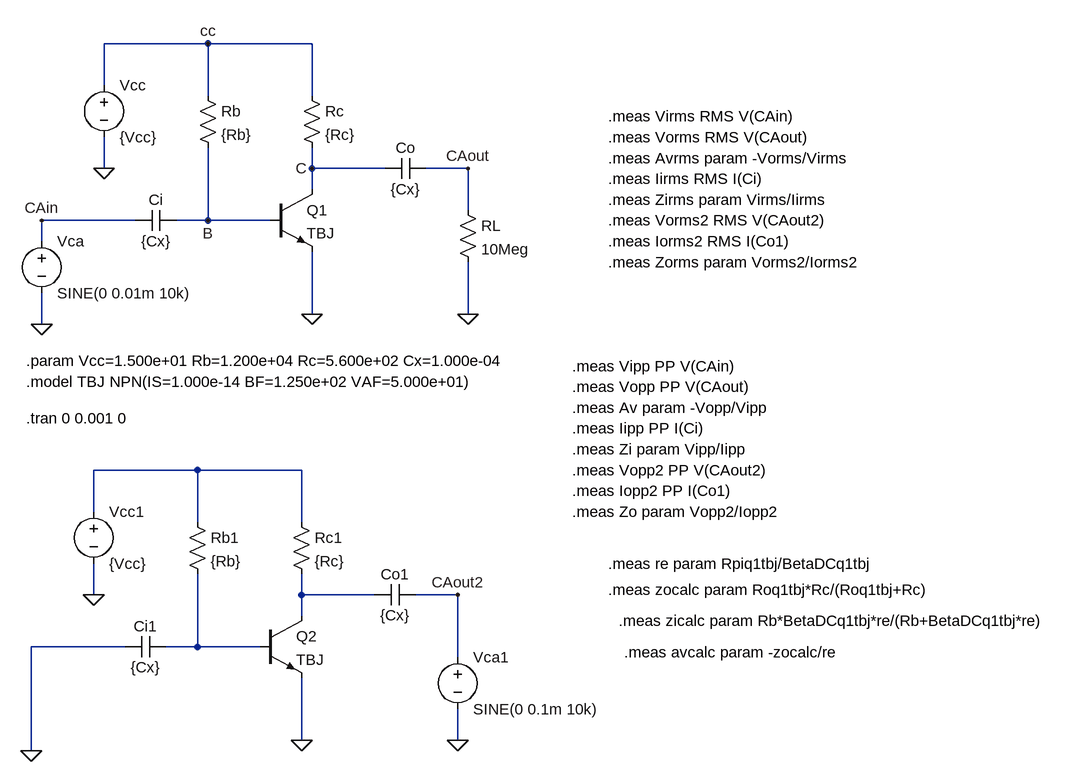
[diagram p0: schematic TBJ01CA.asc]
TBJ01CA.asc, the LTspice schematic file:
Version 4
SHEET 1 1656 1092
WIRE 128 -16 -32 -16
WIRE 288 -16 128 -16
WIRE -32 48 -32 -16
WIRE 128 64 128 -16
WIRE 288 64 288 -16
WIRE -32 176 -32 128
WIRE 288 176 288 144
WIRE 400 176 288 176
WIRE 528 176 464 176
WIRE 288 208 288 176
WIRE 528 240 528 176
WIRE 16 256 -128 256
WIRE 128 256 128 144
WIRE 128 256 80 256
WIRE 224 256 128 256
WIRE -128 288 -128 256
WIRE 288 400 288 304
WIRE 528 400 528 320
WIRE -128 416 -128 368
WIRE 112 640 -48 640
WIRE 272 640 112 640
WIRE -48 704 -48 640
WIRE 112 720 112 640
WIRE 272 720 272 640
WIRE -48 832 -48 784
WIRE 272 832 272 800
WIRE 384 832 272 832
WIRE 512 832 448 832
WIRE 272 864 272 832
WIRE 0 912 -144 912
WIRE 112 912 112 800
WIRE 112 912 64 912
WIRE 208 912 112 912
WIRE 512 928 512 832
WIRE 272 1056 272 960
WIRE 512 1056 512 1008
WIRE -144 1072 -144 912
FLAG -32 176 0
FLAG 288 400 0
FLAG -128 416 0
FLAG 128 -16 cc
FLAG -128 256 CAin
FLAG 528 400 0
FLAG 528 176 CAout
FLAG 128 256 B
FLAG 288 176 C
FLAG -48 832 0
FLAG 272 1056 0
FLAG -144 1072 0
FLAG 512 1056 0
FLAG 512 832 CAout2
SYMBOL res 112 48 R0
SYMATTR InstName Rb
SYMATTR Value {Rb}
SYMBOL res 272 48 R0
SYMATTR InstName Rc
SYMATTR Value {Rc}
SYMBOL voltage -32 32 R0
WINDOW 123 0 0 Left 0
WINDOW 39 0 0 Left 0
SYMATTR InstName Vcc
SYMATTR Value {Vcc}
SYMBOL npn 224 208 R0
SYMATTR InstName Q1
SYMATTR Value TBJ
SYMBOL cap 80 240 R90
WINDOW 0 0 32 VBottom 2
WINDOW 3 32 32 VTop 2
SYMATTR InstName Ci
SYMATTR Value {Cx}
SYMBOL cap 464 160 R90
WINDOW 0 0 32 VBottom 2
WINDOW 3 32 32 VTop 2
SYMATTR InstName Co
SYMATTR Value {Cx}
SYMBOL voltage -128 272 R0
WINDOW 123 0 0 Left 0
WINDOW 39 0 0 Left 0
SYMATTR InstName Vca
SYMATTR Value SINE(0 0.01m 10k)
SYMBOL res 512 224 R0
SYMATTR InstName RL
SYMATTR Value 10Meg
SYMBOL res 96 704 R0
SYMATTR InstName Rb1
SYMATTR Value {Rb}
SYMBOL res 256 704 R0
SYMATTR InstName Rc1
SYMATTR Value {Rc}
SYMBOL voltage -48 688 R0
WINDOW 123 0 0 Left 0
WINDOW 39 0 0 Left 0
SYMATTR InstName Vcc1
SYMATTR Value {Vcc}
SYMBOL npn 208 864 R0
SYMATTR InstName Q2
SYMATTR Value TBJ
SYMBOL cap 64 896 R90
WINDOW 0 0 32 VBottom 2
WINDOW 3 32 32 VTop 2
SYMATTR InstName Ci1
SYMATTR Value {Cx}
SYMBOL cap 448 816 R90
WINDOW 0 0 32 VBottom 2
WINDOW 3 32 32 VTop 2
SYMATTR InstName Co1
SYMATTR Value {Cx}
SYMBOL voltage 512 912 R0
WINDOW 123 0 0 Left 0
WINDOW 39 0 0 Left 0
SYMATTR InstName Vca1
SYMATTR Value SINE(0 0.1m 10k)
TEXT -152 560 Left 2 !.tran 0 0.001 0
TEXT -152 472 Left 2 !.param Vcc=1.500e+01 Rb=1.200e+04 Rc=5.600e+02 Cx=1.000e-04
TEXT -152 504 Left 2 !.model TBJ NPN(IS=1.000e-14 BF=1.250e+02 VAF=5.000e+01)
TEXT 688 480 Left 2 !.meas Vipp PP V(CAin)
TEXT 688 576 Left 2 !.meas Iipp PP I(Ci)
TEXT 688 608 Left 2 !.meas Zi param Vipp/Iipp
TEXT 688 512 Left 2 !.meas Vopp PP V(CAout)
TEXT 688 544 Left 2 !.meas Av param -Vopp/Vipp
TEXT 688 640 Left 2 !.meas Vopp2 PP V(CAout2)
TEXT 688 672 Left 2 !.meas Iopp2 PP I(Co1)
TEXT 688 704 Left 2 !.meas Zo param Vopp2/Iopp2
TEXT 744 96 Left 2 !.meas Virms RMS V(CAin)
TEXT 744 192 Left 2 !.meas Iirms RMS I(Ci)
TEXT 744 224 Left 2 !.meas Zirms param Virms/Iirms
TEXT 744 128 Left 2 !.meas Vorms RMS V(CAout)
TEXT 744 160 Left 2 !.meas Avrms param -Vorms/Virms
TEXT 744 256 Left 2 !.meas Vorms2 RMS V(CAout2)
TEXT 744 288 Left 2 !.meas Iorms2 RMS I(Co1)
TEXT 744 320 Left 2 !.meas Zorms param Vorms2/Iorms2
TEXT 744 784 Left 2 !.meas re param Rpiq1tbj/BetaDCq1tbj
TEXT 744 824 Left 2 !.meas zocalc param Roq1tbj*Rc/(Roq1tbj+Rc)
TEXT 760 872 Left 2 !.meas zicalc param Rb*BetaDCq1tbj*re/(Rb+BetaDCq1tbj*re)
TEXT 768 920 Left 2 !.meas avcalc param -zocalc/re

The netlist it stands for:
* TBJ01CA.asc
Rb cc B {Rb}
Rc cc C {Rc}
Vcc cc 0 {Vcc}
Q1 C B 0 0 TBJ
Ci B CAin {Cx}
Co CAout C {Cx}
Vca CAin 0 SINE(0 0.01m 10k)
RL CAout 0 10Meg
Rb1 N001 N003 {Rb}
Rc1 N001 N002 {Rc}
Vcc1 N001 0 {Vcc}
Q2 N002 N003 0 0 TBJ
Ci1 N003 0 {Cx}
Co1 CAout2 N002 {Cx}
Vca1 CAout2 0 SINE(0 0.1m 10k)
.model NPN NPN
.model PNP PNP
.lib standard.bjt
.tran 0 0.001 0
.param Vcc=1.500e+01 Rb=1.200e+04 Rc=5.600e+02 Cx=1.000e-04
.model TBJ NPN(IS=1.000e-14 BF=1.250e+02 VAF=5.000e+01)
.meas Vipp PP V(CAin)
.meas Iipp PP I(Ci)
.meas Zi param Vipp/Iipp
.meas Vopp PP V(CAout)
.meas Av param -Vopp/Vipp
.meas Vopp2 PP V(CAout2)
.meas Iopp2 PP I(Co1)
.meas Zo param Vopp2/Iopp2
.meas Virms RMS V(CAin)
.meas Iirms RMS I(Ci)
.meas Zirms param Virms/Iirms
.meas Vorms RMS V(CAout)
.meas Avrms param -Vorms/Virms
.meas Vorms2 RMS V(CAout2)
.meas Iorms2 RMS I(Co1)
.meas Zorms param Vorms2/Iorms2
.meas re param Rpiq1tbj/BetaDCq1tbj
.meas zocalc param Roq1tbj*Rc/(Roq1tbj+Rc)
.meas zicalc param Rb*BetaDCq1tbj*re/(Rb+BetaDCq1tbj*re)
.meas avcalc param -zocalc/re
.backanno
.end